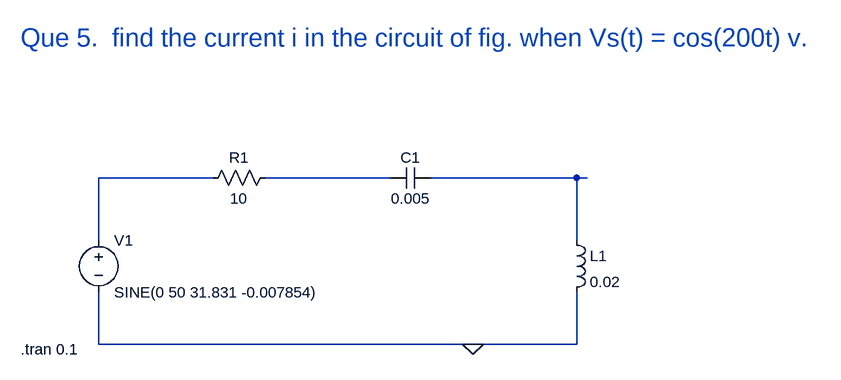
[diagram p0: schematic 5_Dheerendra_23EE019_AC_transient.asc]
5_Dheerendra_23EE019_AC_transient.asc, the LTspice schematic file:
Version 4
SHEET 1 1036 680
WIRE -32 80 -208 80
WIRE 240 80 48 80
WIRE 528 80 304 80
WIRE 544 80 528 80
WIRE -208 176 -208 80
WIRE 528 176 528 80
WIRE -208 336 -208 256
WIRE 368 336 -208 336
WIRE 528 336 528 256
WIRE 528 336 368 336
FLAG 368 336 0
SYMBOL voltage -208 160 R0
WINDOW 123 0 0 Left 0
WINDOW 39 0 0 Left 0
SYMATTR InstName V1
SYMATTR Value SINE(0 50 31.831 -0.007854)
SYMBOL res 64 64 R90
WINDOW 0 0 56 VBottom 2
WINDOW 3 32 56 VTop 2
SYMATTR InstName R1
SYMATTR Value 10
SYMBOL cap 304 64 R90
WINDOW 0 0 32 VBottom 2
WINDOW 3 32 32 VTop 2
SYMATTR InstName C1
SYMATTR Value 0.005
SYMBOL ind 512 160 R0
SYMATTR InstName L1
SYMATTR Value 0.02
TEXT -328 -136 Left 4 ;Que 5.  find the current i in the circuit of fig. when Vs(t) = cos(200t) v.
TEXT -328 344 Left 2 !.tran 0.1

The netlist it stands for:
* 5_Dheerendra_23EE019_AC_transient.asc
V1 N001 0 SINE(0 50 31.831 -0.007854)
R1 N002 N001 10
C1 N003 N002 0.005
L1 N003 0 0.02
* Que 5.  find the current i in the circuit of fig. when Vs(t) = cos(200t) v.
.tran 0.1
.backanno
.end